# Altium schematic sheet PowerSupply.SchDoc: TE0890 - S7Mini
size A4; PageSetup: Record=PageOptions|CenterHorizontal=True|CenterVertical=True|PrintScale=0.96|XCorrection=1.00|YCorrection=1.00|PrintKind=0|BorderSize=5000000|LeftOffset=0|BottomOffset=0|Orientation=2|PaperLength=1000|PaperWidth=1000|Scale=100|PaperSource=7|PrintQuality=-4|MediaType=1|DitherType=10|PaperKind=A4|PrintScaleMode=1; Organization: Trenz Electronic GmbH; DocumentNumber: TE0890; Revision: 01; SheetNumber: 6; SheetTotal: 6; Date: 2018-08-06; Author: Vitali Tsiukala; CompanyName: Trenz Electronic GmbH; DrawnBy: Vitali Tsiukala; Engineer: Vitali Tsiukala; ProjectName: TE0723 Arduino
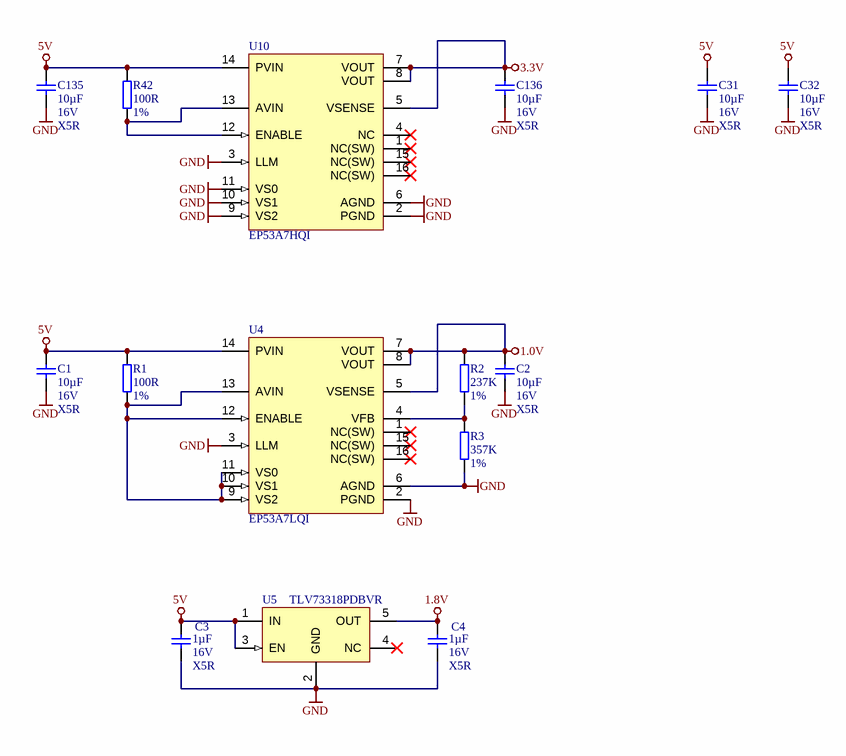
[diagram p0: PowerSupply.SchDoc]

## Parts
C1  10µF  Voltage: 16V  Technology: X5R  [CAPC1608X90N]
C2  10µF  Voltage: 16V  Technology: X5R  [CAPC1608X90N]
C3  1µF  Voltage: 16V  Technology: X5R  [CAPC1005X55N]
C4  1µF  Voltage: 16V  Technology: X5R  [CAPC1005X55N]
C31  10µF  Voltage: 16V  Technology: X5R  [CAPC1608X90N]
C32  10µF  Voltage: 16V  Technology: X5R  [CAPC1608X90N]
C135  10µF  Voltage: 16V  Technology: X5R  [CAPC1608X90N]
C136  10µF  Voltage: 16V  Technology: X5R  [CAPC1608X90N]
R1  100R  Tolerance: 1%  [RESC1005X40N]
R2  237K  Tolerance: 1%  [RESC1005X40N]
R3  357K  Tolerance: 1%  [RESC1005X40N]
R42  100R  Tolerance: 1%  [RESC1005X40N]
U4  EP53A7LQI  [EP53F8QI]
U5  TLV73318PDBVR  [SOT95P280X145-5N]
U10  EP53A7HQI  [EP53F8QI]

## Nets
1.0V: C2.2 R2.1 U4.5(VSENSE) U4.7(VOUT) U4.8(VOUT)
1.8V: C4.1 U5.5(OUT)
3.3V: C136.2 U10.5(VSENSE) U10.7(VOUT) U10.8(VOUT)
5V: C1.2 C3.1 C31.2 C32.2 C135.2 R1.1 R42.1 U4.14(PVIN) U5.1(IN) U5.3(EN) U10.14(PVIN)
GND: C1.1 C2.1 C3.2 C4.2 C31.1 C32.1 C135.1 C136.1 R3.2 U4.2(PGND) U4.3(LLM) U4.6(AGND) U5.2(GND) U10.2(PGND) U10.3(LLM) U10.6(AGND) U10.9(VS2) U10.10(VS1) U10.11(VS0)
NetR1_2: R1.2 U4.9(VS2) U4.10(VS1) U4.11(VS0) U4.12(ENABLE) U4.13(AVIN)
NetR2_2: R2.2 R3.1 U4.4(VFB)
NetR42_2: R42.2 U10.12(ENABLE) U10.13(AVIN)

Not connected (* = marked no-connect by the designer): U4 1(NC(SW))* 15(NC(SW))* 16(NC(SW))*; U5 4(NC)*; U10 1(NC(SW))* 4(NC)* 15(NC(SW))* 16(NC(SW))*

## Notes on the sheet
- Title:
- Number:
- Rev.
- Date:
- A4
- Copyright:
- Page
- of
- Filename:

## Library data of the parts
C1 C2 C31 C32 C135 C136 = 25341: KON 10µF 16V X5R 20% SMD BF 1608 (0603); AN: 25341; Value: 10u; Mixed: SMT; Preferred: Yes; Temperature-Range: -55/+85; Case: 1608 (0603); Tolerance: 20%
C3 C4 = 26579: KON 1µF 16V X5R 10% SMD BF 1005 (0402); AN: 26579; Mixed: SMT; Value: 1u; Temperature-Range: -55/+85; Case: 1005 (0402); Tolerance: 10%
R1 R42 = 22507: WID SMD 100R 1% 0,063W  BF 1005 (0402); AN: 22507; Mixed: SMT; Value: 100; Preferred: Yes; H-ART: RC0402FR-13100RL; Case: 1005 (0402); Technology: TK100
R2 = 24549: WID SMD 237K 1% 0,063W; AN: 24549; Mixed: SMT; Preferred: Yes; H-ART: RC0402FR-07237KL; Case: 1005 (0402); Technology: TK100; Value: 237K
R3 = 25437: WID SMD 357K 1% 0,063W; AN: 25437; Mixed: SMT; Preferred: Yes; Case: 1005 (0402); Technology: TK100; Value: 357k
U4 = 28280: AN: 28280; Mixed: SMT; Trenz-Stock: Yes; Case: QFN16; HelpURL: B:\AD\adlib\datasheet\EP53A7HQI; H-ART: EP53A7LQI; Preferred: Yes
U5 = 28418: TLV73318PDBV; AN: 28418; Voltage: 1.8V; Mixed: SMT; Case: SOT23-3; HelpURL: b:\AD\adlib\datasheet\TLV733xx\; H-ART: TLV73318PDBV
U10 = 27996: AN: 27996; Mixed: SMT; Trenz-Stock: Yes; Case: QFN16; HelpURL: B:\AD\adlib\datasheet\EP53A7HQI; Preferred: Yes; H-ART: EP53A7HQI